# Altium schematic sheet PowerSupply.SchDoc: HM-CORE PowerSupply
size A4; PageSetup: Record=PageOptions|CenterHorizontal=True|CenterVertical=True|PrintScale=1.00|XCorrection=1.00|YCorrection=1.00|PrintKind=0|BorderSize=5000000|LeftOffset=0|BottomOffset=0|Orientation=2|PaperLength=1000|PaperWidth=1000|Scale=100|PaperSource=7|PrintQuality=-3|MediaType=1|DitherType=10|PrintScaleMode=1|PaperKind=A4|PaperIndex=9; Organization: Trenz Electronic GmbH; Revision: A; SheetNumber: 11; SheetTotal: 12; Date: 08.07.2015; Author: Indrek Tubalkain; CompanyName: Trenz Electronic GmbH; DrawnBy: Indrek Tubalkain; Engineer: Indrek Tubalkain; ProjectName: TE0723 Arduino
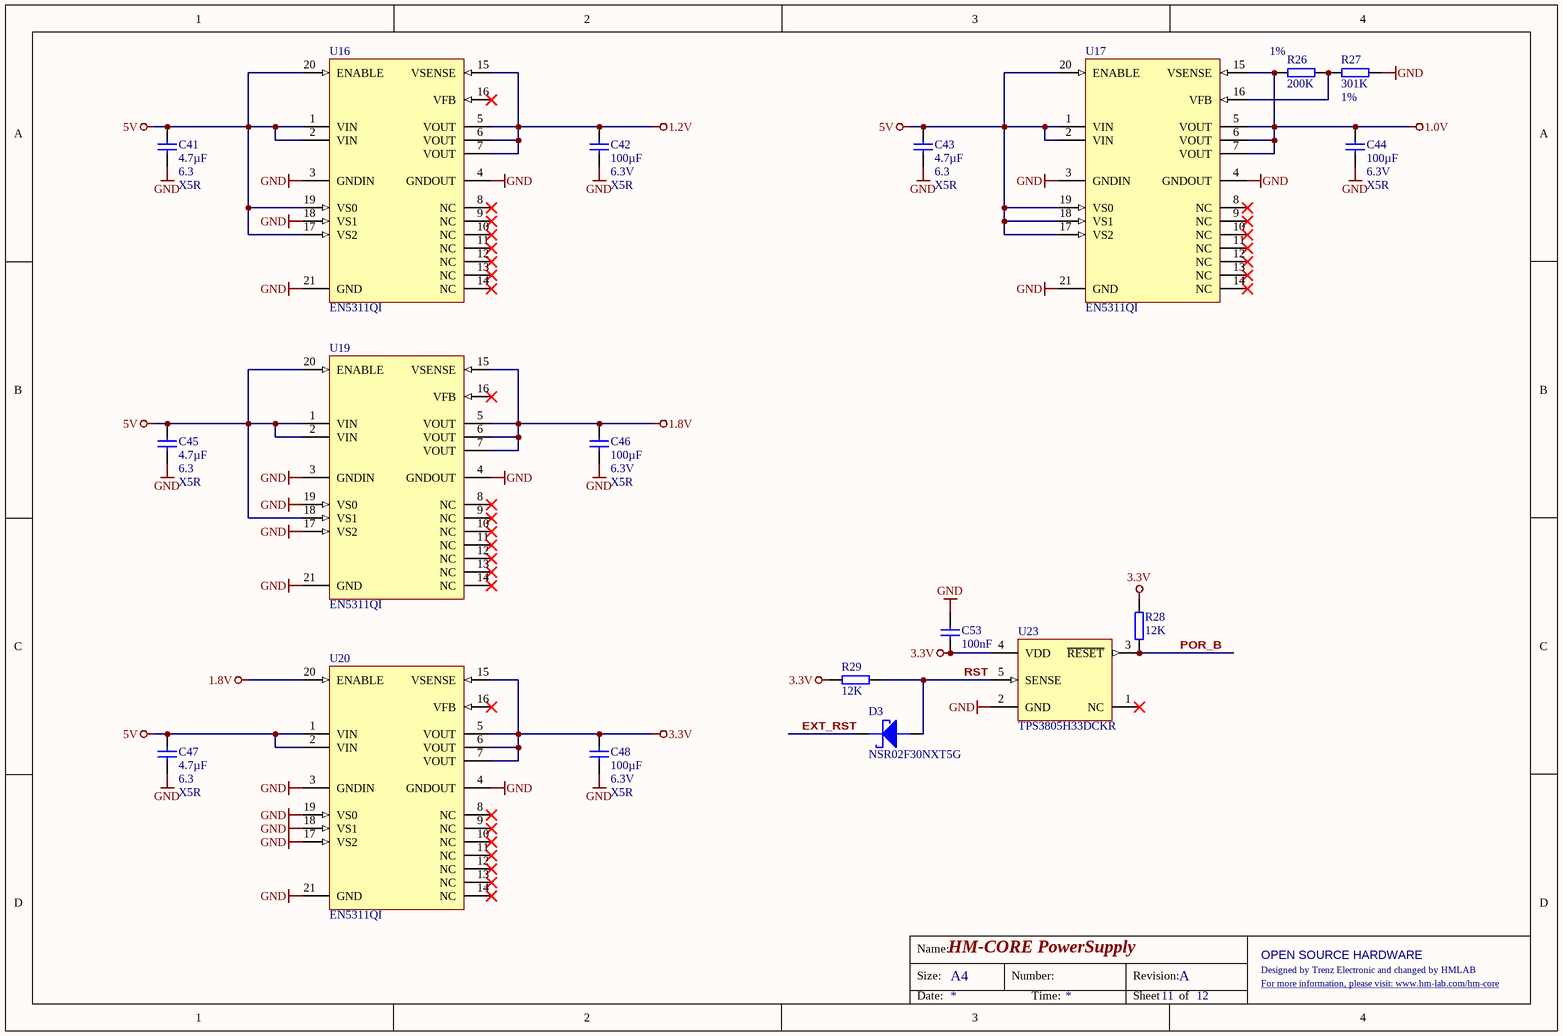
[diagram p0: PowerSupply.SchDoc]

## Parts
C41  4.7µF  Voltage: 6.3  Technology: X5R  [CAPC1005X60N]
C42  100µF  Voltage: 6.3V  Technology: X5R  [CAPC3216X180N]
C43  4.7µF  Voltage: 6.3  Technology: X5R  [CAPC1005X60N]
C44  100µF  Voltage: 6.3V  Technology: X5R  [CAPC3216X180N]
C45  4.7µF  Voltage: 6.3  Technology: X5R  [CAPC1005X60N]
C46  100µF  Voltage: 6.3V  Technology: X5R  [CAPC3216X180N]
C47  4.7µF  Voltage: 6.3  Technology: X5R  [CAPC1005X60N]
C48  100µF  Voltage: 6.3V  Technology: X5R  [CAPC3216X180N]
C53  100nF  [CAPC1005X55N]
D3  NSR02F30NXT5G  [DIOC0603X30N]
R26  200K  Tolerance: 1%  [RESC1005X40N]
R27  301K  Tolerance: 1%  [RESC1005X40N]
R28  12K  [RESC1005X40N]
R29  12K  [RESC1005X40N]
U16  EN5311QI  [EN5311QI]
U17  EN5311QI  [EN5311QI]
U19  EN5311QI  [EN5311QI]
U20  EN5311QI  [EN5311QI]
U23  TPS3805H33DCKR  [SOT65P210X110-5N]

## Nets
1.0V: C44.1 R26.1 U17.5(VOUT) U17.6(VOUT) U17.7(VOUT) U17.15(VSENSE)
1.2V: C42.1 U16.5(VOUT) U16.6(VOUT) U16.7(VOUT) U16.15(VSENSE)
1.8V: C46.1 U19.5(VOUT) U19.6(VOUT) U19.7(VOUT) U19.15(VSENSE) U20.20(ENABLE)
3.3V: C48.1 C53.2 R28.2 R29.2 U20.5(VOUT) U20.6(VOUT) U20.7(VOUT) U20.15(VSENSE) U23.4(VDD)
5V: C41.1 C43.1 C45.1 C47.1 U16.1(VIN) U16.2(VIN) U16.17(VS2) U16.19(VS0) U16.20(ENABLE) U17.1(VIN) U17.2(VIN) U17.17(VS2) U17.18(VS1) U17.19(VS0) U17.20(ENABLE) U19.1(VIN) U19.2(VIN) U19.18(VS1) U19.20(ENABLE) U20.1(VIN) U20.2(VIN)
GND: C41.2 C42.2 C43.2 C44.2 C45.2 C46.2 C47.2 C48.2 C53.1 R27.2 U16.3(GNDIN) U16.4(GNDOUT) U16.18(VS1) U16.21(GND) U17.3(GNDIN) U17.4(GNDOUT) U17.21(GND) U19.3(GNDIN) U19.4(GNDOUT) U19.17(VS2) U19.19(VS0) U19.21(GND) U20.3(GNDIN) U20.4(GNDOUT) U20.17(VS2) U20.18(VS1) U20.19(VS0) U20.21(GND) U23.2(GND)
EXT_RST: D3.1(KATHODE)
POR_B: R28.1 U23.3(~{RESET})
RST: D3.2(ANODE) R29.1 U23.5(SENSE)
NetR26_2: R26.2 R27.1 U17.16(VFB)

Not connected (* = marked no-connect by the designer): U16 8(NC)* 9(NC)* 10(NC)* 11(NC)* 12(NC)* 13(NC)* 14(NC)* 16(VFB)*; U17 8(NC)* 9(NC)* 10(NC)* 11(NC)* 12(NC)* 13(NC)* 14(NC)*; U19 8(NC)* 9(NC)* 10(NC)* 11(NC)* 12(NC)* 13(NC)* 14(NC)* 16(VFB)*; U20 8(NC)* 9(NC)* 10(NC)* 11(NC)* 12(NC)* 13(NC)* 14(NC)* 16(VFB)*; U23 1(NC)*

## Notes on the sheet
- Name:
- Size:
- A4
- Number:
- Revision:
- Designed by Trenz Electronic and changed by HMLAB
- OPEN SOURCE HARDWARE
- For more information, please visit: www.hm-lab.com/hm-core <http://hm-lab.com/hm-core>
- Date:
- Time:
- Sheet
- of

## Library data of the parts
C41 C43 C45 C47 = 24719: KON 4.7µF 6.3V X5R SMD 20%; AN: 24719; Mixed: SMT; Value: 4.7u; Preferred: Yes; Case: 1005 (0402); Tolerance: 20%
C42 C44 C46 C48 = 23116: KON 100µF 6,3V X5R SMD 20%; AN: 23116; Mixed: SMT; Value: 100u; Preferred: Yes; Case: 3216 (1206); Tolerance: 20%
C53 = 26183: KON 100nF 50V SMD AEC-Q200; AN: 26183; Tolerance: 10%; Mixed: SMT; Value: 100n; Case: 1005 (0402); Voltage: 50V; Technology: X7R
D3 = 26175: AN: 26175; Mixed: SMT; Trenz-Stock: Yes; Case: DSN2 - 0201; HelpURL: B:\ad\adlib\datasheet\NSR02F30NXT5G
R26 = 23846: WID SMD 200K 1% 0,063W; AN: 23846; Mixed: SMT; Preferred: Yes; Case: 1005 (0402); Value: 200K
R27 = 26224: WID SMD 301K 1% 0,063W; AN: 26224; Mixed: SMT; Case: 1005 (0402); Value: 301k
R28 R29 = 22598: WID SMD 12K 1% 0,063W; AN: 22598; Mixed: SMT; Preferred: Yes; Case: 1005 (0402); Value: 12K
U16 U17 U19 U20 = 25492: AN: 25492; Mixed: SMT; Trenz-Stock: Yes; Case: QFN20; HelpURL: B:\AD\adlib\datasheet\EN5311QI; Preferred: Yes
U23 = 25049: AN: 25049; Mixed: SMT; Trenz-Stock: Yes; Case: SC70-5 / SC88A / SOT353; HelpURL: B:\AD\adlib\datasheet\TPS3805H33; Preferred: Yes